# Altium project Receiver.PrjPcb
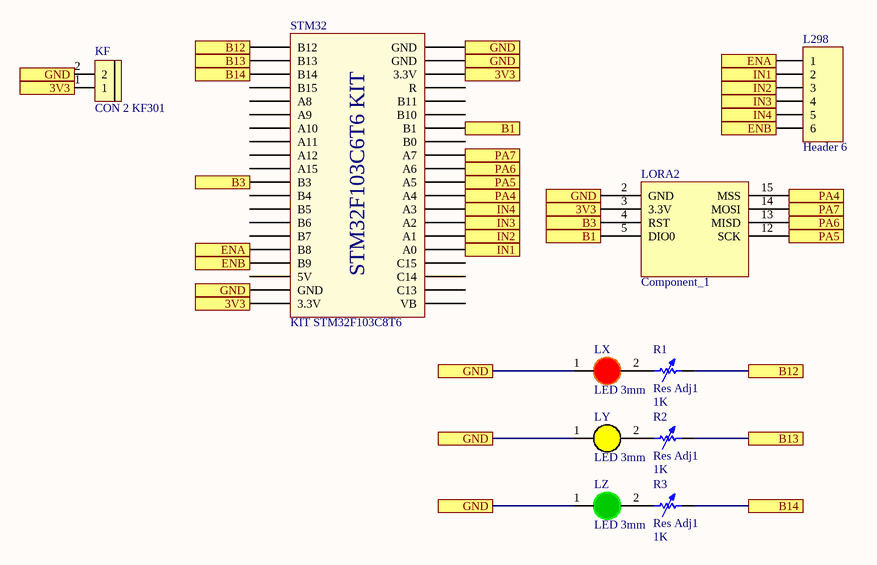
[diagram p0: Receiver.SchDoc]
1 sheet, 10 parts. Net scope: flat (ports and power ports of the same name join across sheets).
Board file: Receiver.PcbDoc

## Sheet Receiver.SchDoc
size A; SheetNumber: 1; SheetTotal: 1

### Parts
KF  CON 2 KF301  [Con 2 KF301 5.08]
L298  Header 6  [HDR1X6]
LORA2  Component_1  [DIP16 - duplicate1]
LX  LED 3mm  [LED-3MM-RED]
LY  LED 3mm  [LED-3MM-YELLOW]
LZ  LED 3mm  [LED-3MM-GREEN]
R1  Res Adj1  value 1K  [AXIAL-0.7]
R2  Res Adj1  value 1K  [AXIAL-0.7]
R3  Res Adj1  value 1K  [AXIAL-0.7]
STM32  KIT STM32F103C8T6  [STM32F103 KIT]

### Ports
3V3, B1, B3, B12, B13, B14, ENA, ENB, GND, IN1, IN2, IN3, IN4, PA4, PA5, PA6, PA7

### Nets
NetKF_1: KF.1 LORA2.3(3.3V) STM32.20(3.3V) STM32.38(3.3V) ; port 3V3
NetKF_2: KF.2 LORA2.2(GND) LX.1(A) LY.1(A) LZ.1(A) STM32.19(GND) STM32.39(GND) STM32.40(GND) ; port GND
NetL298_1: L298.1 STM32.16(B8) ; port ENA
NetL298_2: L298.2 STM32.25(A0) ; port IN1
NetL298_3: L298.3 STM32.26(A1) ; port IN2
NetL298_4: L298.4 STM32.27(A2) ; port IN3
NetL298_5: L298.5 STM32.28(A3) ; port IN4
NetL298_6: L298.6 STM32.17(B9) ; port ENB
NetLORA2_4: LORA2.4(RST) STM32.11(B3) ; port B3
NetLORA2_5: LORA2.5(DIO0) STM32.34(B1) ; port B1
NetLORA2_12: LORA2.12(SCK) STM32.30(A5) ; port PA5
NetLORA2_13: LORA2.13(MISD) STM32.31(A6) ; port PA6
NetLORA2_14: LORA2.14(MOSI) STM32.32(A7) ; port PA7
NetLORA2_15: LORA2.15(MSS) STM32.29(A4) ; port PA4
NetLX_2: LX.2(K) R1.1
NetLY_2: LY.2(K) R2.1
NetLZ_2: LZ.2(K) R3.1
NetR1_2: R1.2 STM32.1(B12) ; port B12
NetR2_2: R2.2 STM32.2(B13) ; port B13
NetR3_2: R3.2 STM32.3(B14) ; port B14

Not connected (* = marked no-connect by the designer): STM32 4(B15) 5(A8) 6(A9) 7(A10) 8(A11) 9(A12) 10(A15) 12(B4) 13(B5) 14(B6) 15(B7) 18(5V) 21(VB) 22(C13) 23(C14) 24(C15) 33(B0) 35(B10) 36(B11) 37(R)

### Notes on the sheet
- (in symbol STM32f103 Bluepill) STM32F103C6T6 KIT

### Library data of the parts
KF = CON 2 KF301: Cắm; Ma_Hang: MH000987; Ten_Linh_Kien: CON 2 KF301-2P 5.08MM Xanh Dương; Chung_Loai: Cắm; Ghi_Chu: *; Kieu_Chan: *; Don_Vi: Con
L298 = Header 6: Header, 6-Pin; LatestRevisionDate: 17-Jul-2002; LatestRevisionNote: Re-released for DXP Platform.; Publisher: Altium Limited
LX = LED 3mm Do: Cắm; Don_Vi: Con; Ma_Hang: MH003892; Ten_Linh_Kien: Led 3MM Phủ Đỏ (10c); Ghi_Chu: *; Kieu_Chan: *; Chung_Loai: Cắm
LY = LED 3mm Vang: Cắm; Don_Vi: Con; Ma_Hang: MH003893; Ten_Linh_Kien: Led 3MM Phủ Vàng (10c); Ghi_Chu: *; Kieu_Chan: *; Chung_Loai: Cắm
LZ = LED 3mm Xanh La: Cắm; Don_Vi: Con; Ma_Hang: MH001054; Ten_Linh_Kien: Led 3MM Phủ Xanh (10c); Ghi_Chu: *; Kieu_Chan: *; Chung_Loai: Cắm
R1-R3 = Res Adj1: Variable Resistor; Set Position: 0.5; Published: 8-Jun-2000; LatestRevisionDate: 17-Jul-2002; LatestRevisionNote: Re-released for DXP Platform.; PackageReference: AXIAL-0.7; Publisher: Altium Limited; PackageDescription: Axial Device, Thru-Hole; 2 Leads; 0.7 in Pin Spacing
STM32 = STM32f103 Bluepill: KIT STM32F103C8T6 Bluepill